# Altium schematic sheet TissuePad_Schematic.SchDoc
size A3; SheetNumber: 1; SheetTotal: 1
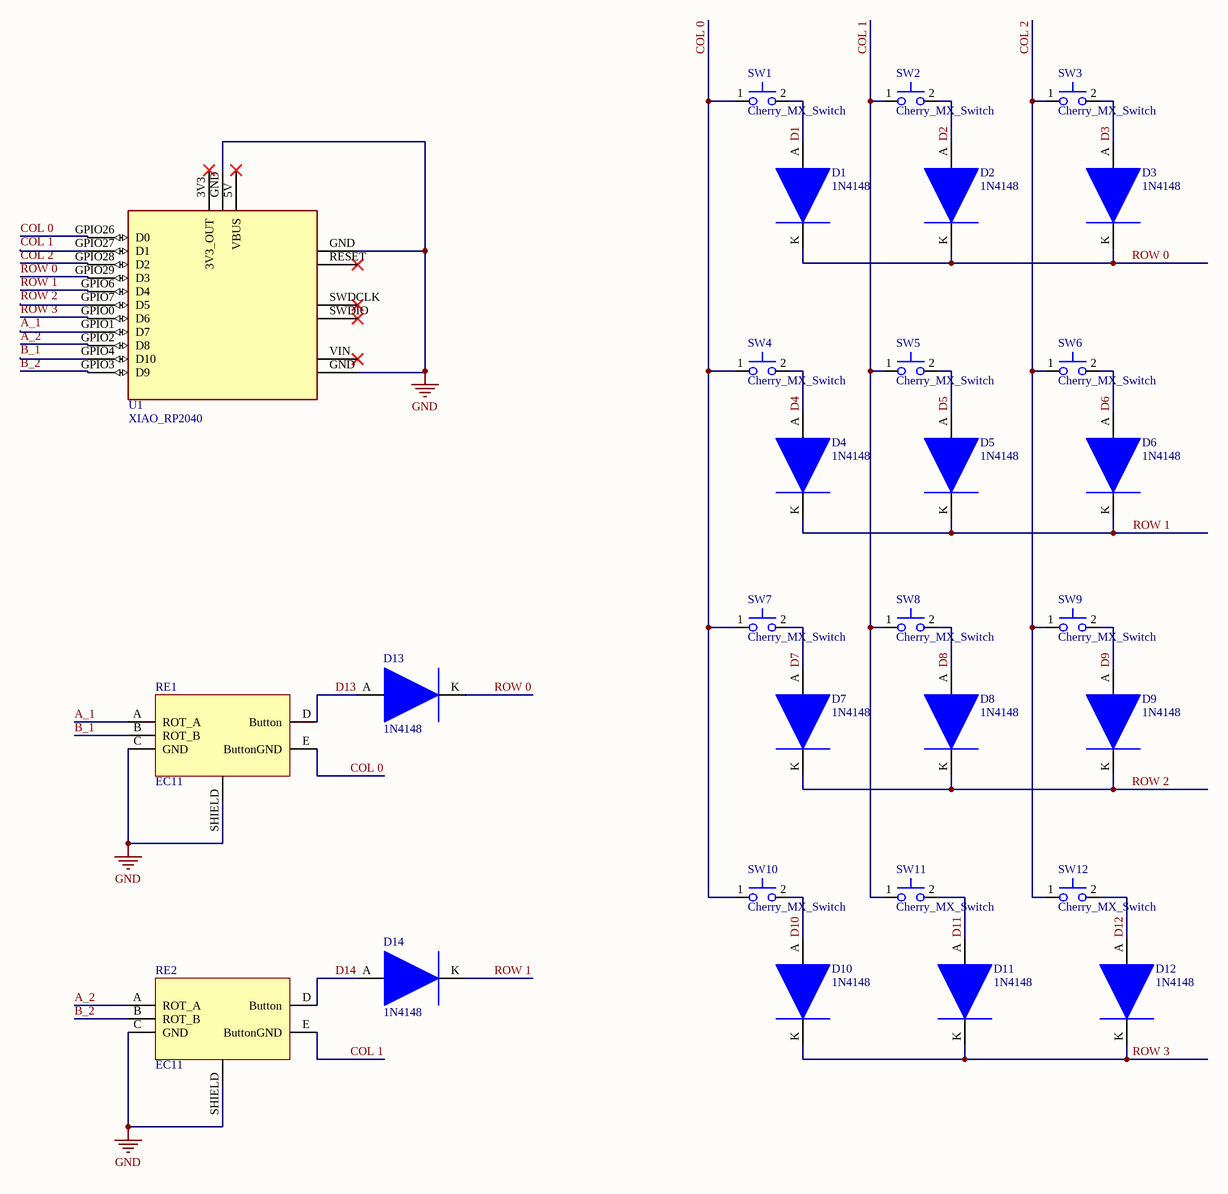
[diagram p0: TissuePad_Schematic.SchDoc]

## Parts
D1  1N4148  [1N4148W]
D2  1N4148  [1N4148W]
D3  1N4148  [1N4148W]
D4  1N4148  [1N4148W]
D5  1N4148  [1N4148W]
D6  1N4148  [1N4148W]
D7  1N4148  [1N4148W]
D8  1N4148  [1N4148W]
D9  1N4148  [1N4148W]
D10  1N4148  [1N4148W]
D11  1N4148  [1N4148W]
D12  1N4148  [1N4148W]
D13  1N4148  [1N4148W]
D14  1N4148  [1N4148W]
RE1  EC11  [EC11E18244AU]
RE2  EC11  [EC11E18244AU]
SW1  Cherry_MX_Switch  [Cherry MX 2 Pin]
SW2  Cherry_MX_Switch  [Cherry MX 2 Pin]
SW3  Cherry_MX_Switch  [Cherry MX 2 Pin]
SW4  Cherry_MX_Switch  [Cherry MX 2 Pin]
SW5  Cherry_MX_Switch  [Cherry MX 2 Pin]
SW6  Cherry_MX_Switch  [Cherry MX 2 Pin]
SW7  Cherry_MX_Switch  [Cherry MX 2 Pin]
SW8  Cherry_MX_Switch  [Cherry MX 2 Pin]
SW9  Cherry_MX_Switch  [Cherry MX 2 Pin]
SW10  Cherry_MX_Switch  [Cherry MX 2 Pin]
SW11  Cherry_MX_Switch  [Cherry MX 2 Pin]
SW12  Cherry_MX_Switch  [Cherry MX 2 Pin]
U1  XIAO_RP2040  [XIAO_RP2040]

## Nets
GND: RE1.C(GND) RE1.SHIELD RE2.C(GND) RE2.SHIELD U1.GND
A_1: RE1.A(ROT_A) U1.GPIO1(D7)
A_2: RE2.A(ROT_A) U1.GPIO2(D8)
B_1: RE1.B(ROT_B) U1.GPIO4(D10)
B_2: RE2.B(ROT_B) U1.GPIO3(D9)
COL 0: RE1.E(ButtonGND) SW1.1 SW4.1 SW7.1 SW10.1 U1.GPIO26(D0)
COL 1: RE2.E(ButtonGND) SW2.1 SW5.1 SW8.1 SW11.1 U1.GPIO27(D1)
COL 2: SW3.1 SW6.1 SW9.1 SW12.1 U1.GPIO28(D2)
D1: D1.A(Anode) SW1.2
D2: D2.A(Anode) SW2.2
D3: D3.A(Anode) SW3.2
D4: D4.A(Anode) SW4.2
D5: D5.A(Anode) SW5.2
D6: D6.A(Anode) SW6.2
D7: D7.A(Anode) SW7.2
D8: D8.A(Anode) SW8.2
D9: D9.A(Anode) SW9.2
D10: D10.A(Anode) SW10.2
D11: D11.A(Anode) SW11.2
D12: D12.A(Anode) SW12.2
D13: D13.A(Anode) RE1.D(Button)
D14: D14.A(Anode) RE2.D(Button)
ROW 0: D1.K(Cathode) D2.K(Cathode) D3.K(Cathode) D13.K(Cathode) U1.GPIO29(D3)
ROW 1: D4.K(Cathode) D5.K(Cathode) D6.K(Cathode) D14.K(Cathode) U1.GPIO6(D4)
ROW 2: D7.K(Cathode) D8.K(Cathode) D9.K(Cathode) U1.GPIO7(D5)
ROW 3: D10.K(Cathode) D11.K(Cathode) D12.K(Cathode) U1.GPIO0(D6)

Not connected (* = marked no-connect by the designer): U1 3V3(3V3_OUT)* 5V(VBUS)* RESET* SWDCLK* SWDIO* VIN*

## Library data of the parts
D1-D14 = 1N4148: Small Signal Fast Switching Diodes
RE1 RE2 = EC11: A Rotary Encoder with Push Button
SW1-SW12 = Cherry_MX_Switch: 2 Pin Cherry MX Switch
U1 = XIAO_RP2040: Seed Studio XIAO_RP2040 MCU Board